# EAGLE schematic main (EAGLE 9.0.1)
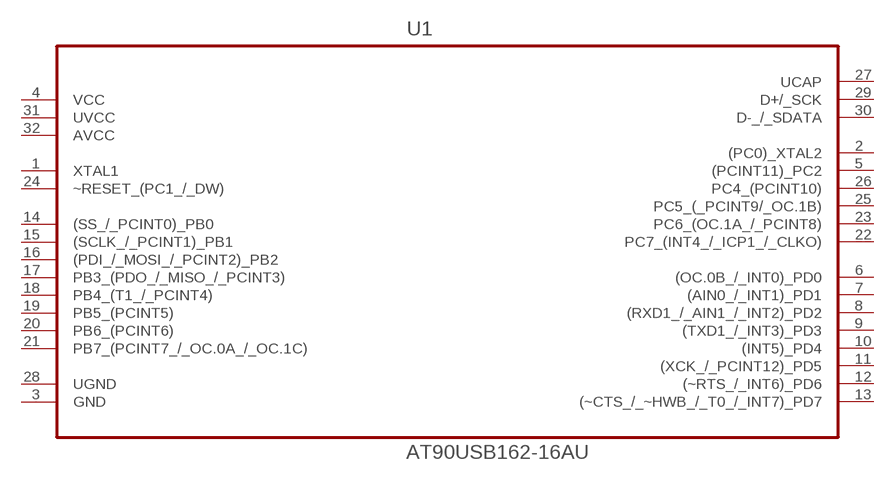
[diagram p0: schematic, sheet 1]

## Parts
U1  AT90USB162-16AU  [QFP80P900X900X120-32N]
Unconnected: U1.1(XTAL1) U1.2((PC0)_XTAL2) U1.3(GND) U1.5((PCINT11)_PC2) U1.6((OC.0B_/_INT0)_PD0) U1.7((AIN0_/_INT1)_PD1) U1.8((RXD1_/_AIN1_/_INT2)_PD2) U1.9((TXD1_/_INT3)_PD3) U1.10((INT5)_PD4) U1.11((XCK_/_PCINT12)_PD5) U1.12((~RTS_/_INT6)_PD6) U1.13((~CTS_/_~HWB_/_T0_/_INT7)_PD7) U1.14((SS_/_PCINT0)_PB0) U1.15((SCLK_/_PCINT1)_PB1) U1.16((PDI_/_MOSI_/_PCINT2)_PB2) U1.17(PB3_(PDO_/_MISO_/_PCINT3)) U1.18(PB4_(T1_/_PCINT4)) U1.19(PB5_(PCINT5)) U1.20(PB6_(PCINT6)) U1.21(PB7_(PCINT7_/_OC.0A_/_OC.1C)) U1.22(PC7_(INT4_/_ICP1_/_CLKO)) U1.23(PC6_(OC.1A_/_PCINT8)) U1.24(~RESET_(PC1_/_DW)) U1.25(PC5_(_PCINT9/_OC.1B)) U1.26(PC4_(PCINT10)) U1.27(UCAP) U1.28(UGND) U1.29(D+/_SCK) U1.30(D-_/_SDATA)

## Power pins joined to a net without a drawn wire
AVCC: U1.32(AVCC)
UVCC: U1.31(UVCC)
VCC: U1.4(VCC)

## Library data of the parts
U1 = Atmel_By_element14_Batch_1-00:AT90USB162-16AU: 8-bit Microcontroller; MPN: AT90USB162-16AU; OC_FARNELL: 1455073; OC_NEWARK: 58M3868; PACKAGE: TQFP-32; SUPPLIER: Atmel